# EAGLE design yunimin1_encoderBoard (EAGLE 4.11)
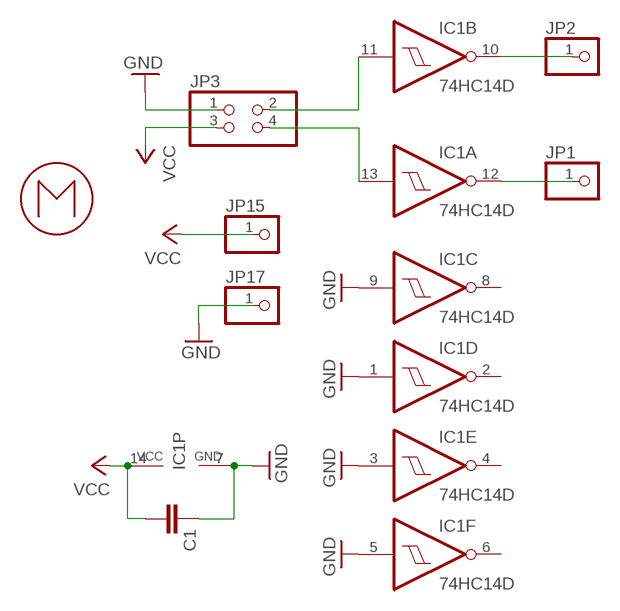
[diagram p0: schematic, sheet 1]

## Parts
C1  C-EUC1206  [C1206]
IC1  74HC14D  [SO14]
JP1  PINHD-1X1  [1X01]
JP2  PINHD-1X1  [1X01]
JP3  PINHD-2X2  [2X02]
JP15  PINHD-1X1  [1X01]
JP17  PINHD-1X1  [1X01]
U$1  MOTORGW8FRONT  [GW8L_FRONT]

## Nets
GND: C1.1 IC1.1(D:I) IC1.3(E:I) IC1.5(F:I) IC1.7(P:GND) IC1.9(C:I) JP3.1 JP17.1
N$1: IC1.11(B:I) JP3.2
N$2: IC1.13(A:I) JP3.4
N$3: IC1.10(B:O) JP2.1
N$4: IC1.12(A:O) JP1.1
VCC: C1.2 IC1.14(P:VCC) JP3.3 JP15.1
Unconnected: IC1.2(D:O) IC1.4(E:O) IC1.6(F:O) IC1.8(C:O)

## Library data of the parts
C1 = rcl:C-EU: CAPACITOR, European symbol
IC1 = 74xx-eu:74*14: Hex schmitt trigger INVERTER
JP1 JP2 JP15 JP17 = pinhead:PINHD-1X1: PIN HEADER
JP3 = pinhead:PINHD-2X2: PIN HEADER
U$1 = motors:MOTORGW8

## Board
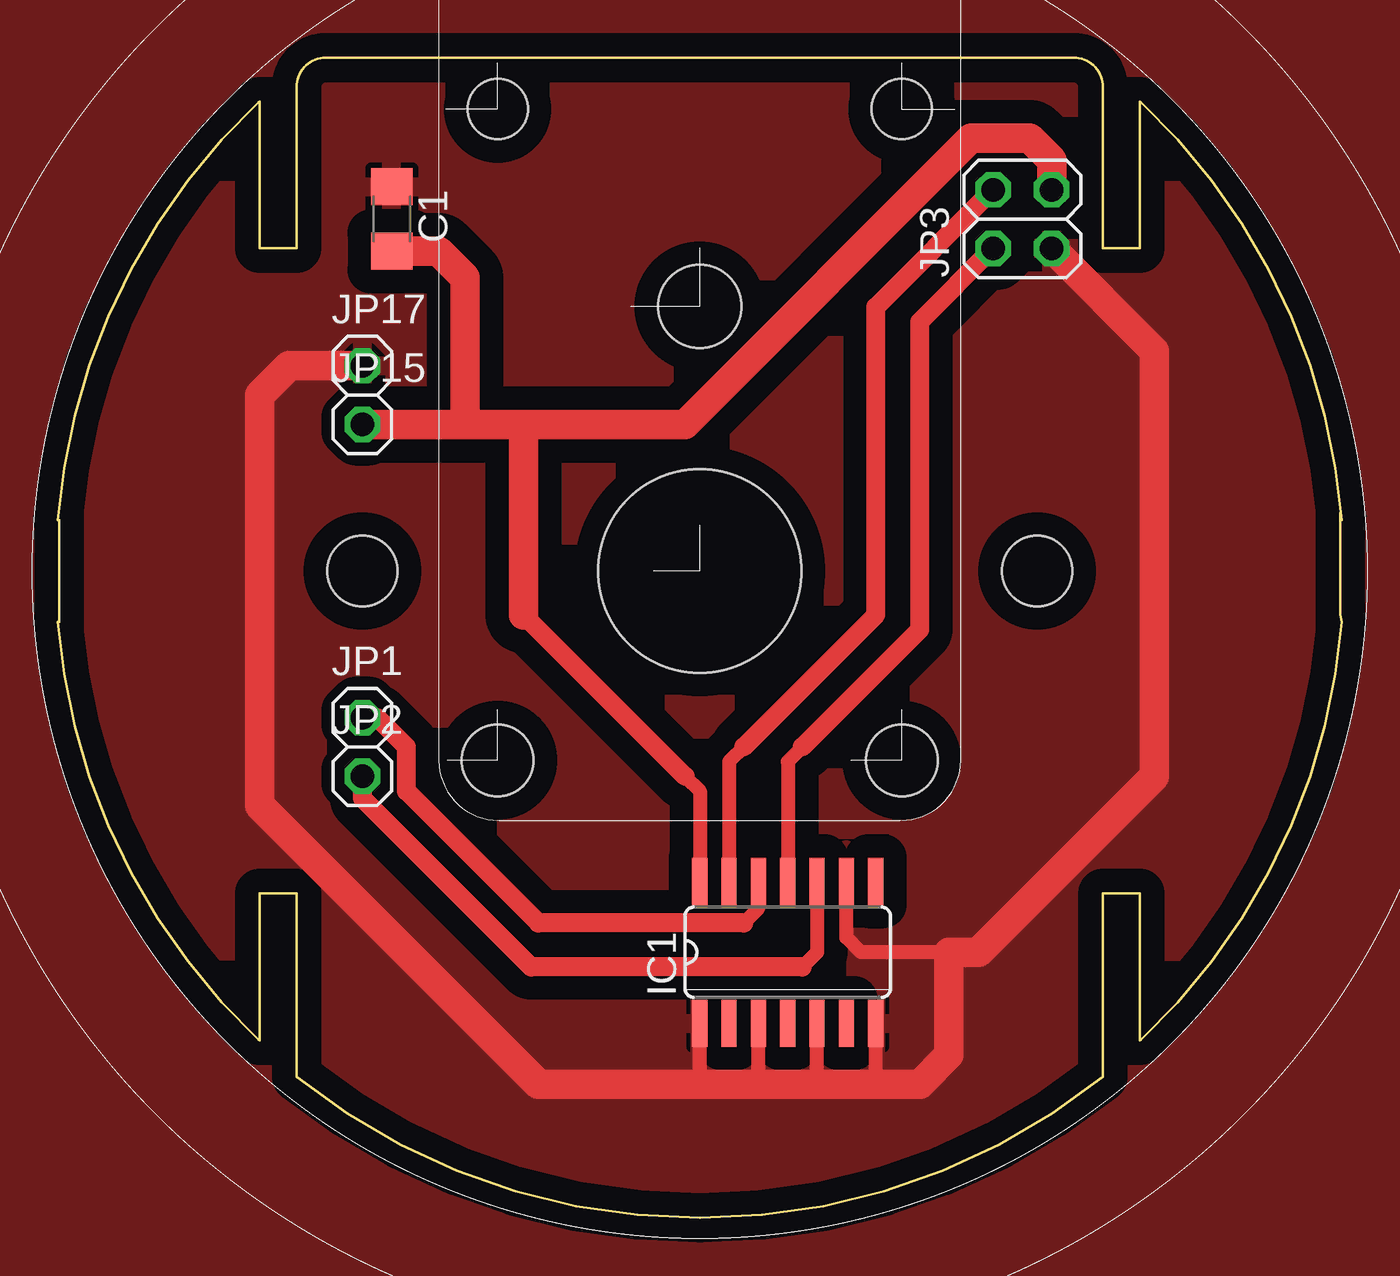
[diagram p1: board, top side]
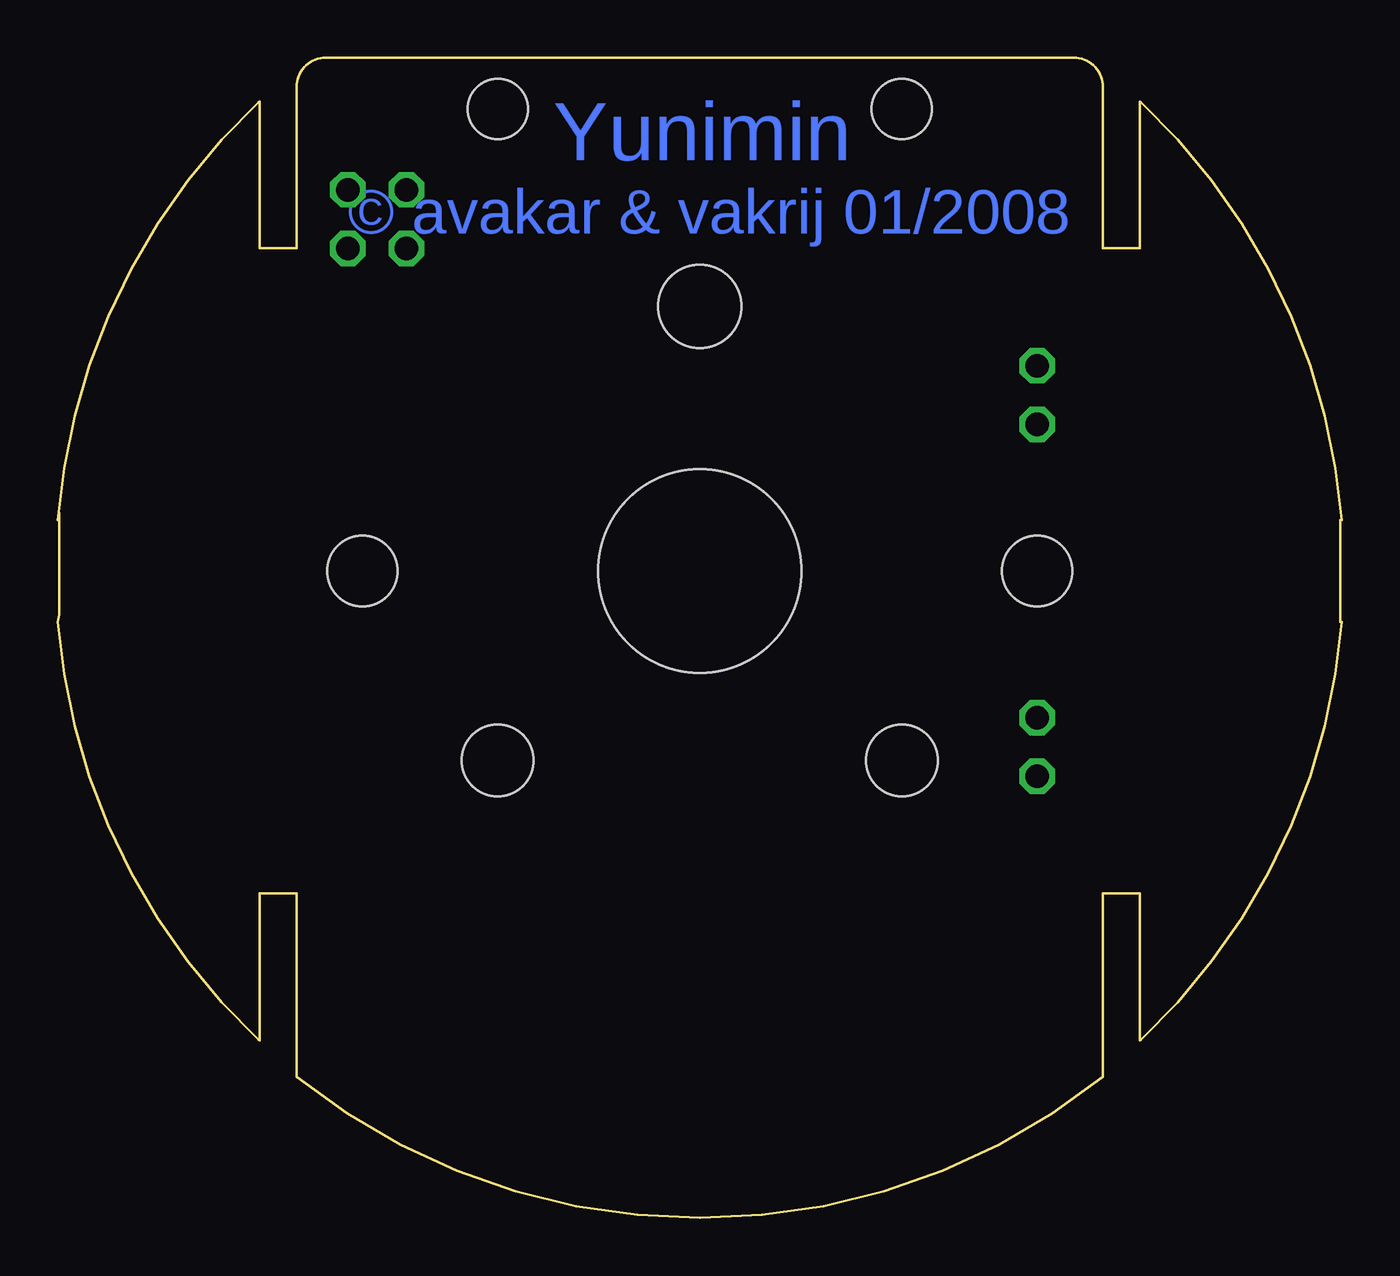
[diagram p2: board, bottom side, seen from below]

Size 55.6 x 50.24 mm. Coordinates in mm from the lower left corner, seen from the top.
Outline: 8.75,48.34 8.75,41.99 10.34,41.99 10.34,48.97 arc-90 11.61,50.24 43.99,50.24 arc-90 45.26,48.97 45.26,41.99 46.85,41.99 46.85,48.34
Outline: 8.75,7.7 8.75,14.05 10.34,14.05 10.34,6.11 arc77 45.26,6.11 45.26,14.05 46.85,14.05 46.85,7.7
Outline: 8.7,48.32 arc42 0,30.22 0.07,30.22 0.07,25.82 0,25.82 arc42 8.7,7.72
Outline: 46.9,7.72 arc42 55.6,25.82 55.53,26.13 55.53,30.53 55.6,30.22 arc42 46.9,48.32
Copper layers (1*16): Top 0.035mm / dielectric 1.5mm / Bottom 0.035mm
Design rules "default": minimum track width 10mil, minimum drill 24mil, track to track 8mil, track to pad 8mil, pad to pad 8mil, via to via 8mil, smd to smd 8mil, copper to edge 8mil, drill to drill 8mil, minimum pad ring 10mil, minimum via ring 8mil, stop-mask expansion 4mil, vias tented up to drill 0mil, thermal gap 10mil
Holes 3.05 mm at 13.2,28.02 42.41,28.02
bRestrict: area 10,24.8 to 16.4,31.2; area 39.2,24.8 to 45.6,31.3

### Footprints (pad centres in the part's own frame; a part is rotated, then mirrored left to right if it is on the bottom)
C1206 = smd 1.6 x 1.8: 1 -1.4,0; 2 1.4,0
SO14 = smd 0.66 x 2.032: 1 -3.81,-3.073; 2 -2.54,-3.073; 3 -1.27,-3.073; 4 0,-3.073; 5 1.27,-3.073; 6 2.54,-3.073; 7 3.81,-3.073; 8 3.81,3.073; 9 2.54,3.073; 10 1.27,3.073; 11 0,3.073; 12 -1.27,3.073; 13 -2.54,3.073; 14 -3.81,3.073
1X01 = drill 1.016 octagon: 1 0,0
2X02 = drill 1.016 octagon: 1 -1.27,-1.27; 2 -1.27,1.27; 3 1.27,-1.27; 4 1.27,1.27
GW8L_FRONT = hole 2.6: 20,8.75; 20,-8.75 | hole 3.1: -8.2,8.75; -8.2,-8.75 | hole 3.6: 11.45,0 | hole 8.8: 0,0

### Placement (x,y rotation side)
C1  14.46,43.26 270 top
IC1  31.61,11.51 0 top
JP1  13.2,21.67 0 top
JP2  13.2,19.13 0 top
JP3  41.77,43.26 90 top
JP15  13.2,34.37 0 top
JP17  13.2,36.91 0 top
U$1  27.8,28.02 90 top

### Tracks (layer width: path | path; a pad name or v marks a point on that pad's centre or on a via)
GND
  Top 0.61: 27.8,5.79 IC1.1 | 32.88,5.79 IC1.5 | 30.34,5.79 IC1.3 | IC1.9 34.15,12.14 34.79,11.51 38.59,11.51 | 35.42,5.79 IC1.7
  Top 1.27: JP3.1 47.48,37.54 47.48,19.13 39.87,11.51 38.59,11.51 38.59,7.06 37.33,5.79 35.42,5.79 32.88,5.79 30.34,5.79 27.8,5.79 20.82,5.79 8.75,17.86 8.75,35.64 10.02,36.91 JP17.1
  pour Top (isolate 1.016): -3.31,54.69 58.91,54.69 58.91,-3.1 -3.31,-3.1
N$1
  Top 0.61: 32.25,20.4 31.61,19.76 IC1.11
  Top 0.813: 32.25,20.4 37.33,25.48 37.33,38.81 JP3.2
N$2
  Top 0.61: 29.71,20.4 29.07,19.76 IC1.13
  Top 0.813: 29.71,20.4 35.42,26.11 35.42,39.45 JP3.4
N$3
  Top 0.61: IC1.10 32.88,11.51 32.25,10.87
  Top 0.813: JP2.1 13.2,18.17 20.5,10.87 32.25,10.87
N$4
  Top 0.61: IC1.12 30.34,13.41 29.71,12.78
  Top 0.813: JP1.1 13.83,21.67 15.1,20.4 15.1,18.49 20.82,12.78 29.71,12.78
VCC
  Top 0.61: 27.16,19.13 27.8,18.49 IC1.14
  Top 0.813: 20.18,26.11 27.16,19.13
  Top 1.27: JP3.3 43.04,45.8 42.09,46.75 39.55,46.75 27.16,34.37 17.64,34.37 | 17.64,34.37 20.18,34.37 20.18,26.11 | C1.2 16.5,41.86 17.64,40.72 17.64,34.37 | 17.64,34.37 JP15.1

### Text on the board
Bottom: Yunimin | © avakar & vakrij 01/2008